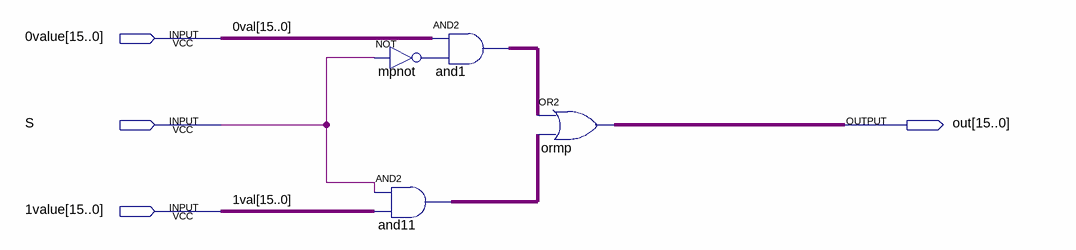
[diagram p0: schematic sheet]
// Quartus schematic Mulchplexer.bdf as structural Verilog: 4 symbols, 4 pins
module Mulchplexer (
  input  [15:0] \0value ,
  input  S,
  input  [15:0] \1value ,
  output [15:0] out
);

  wire mpnot_out;
  wire [15:0] and1_out, and11_out;

  not mpnot (mpnot_out, S);
  assign and11_out = {16{S}} & \1value ;  // AND2 and11, 16 bits wide
  assign and1_out = \0value  & {16{mpnot_out}};  // AND2 and1, 16 bits wide
  assign out = and1_out | and11_out;  // OR2 ormp, 16 bits wide

  // Other names for the same wires on the sheet: 0val[15:0] = \0value ; 1val[15:0] = \1value 
endmodule
